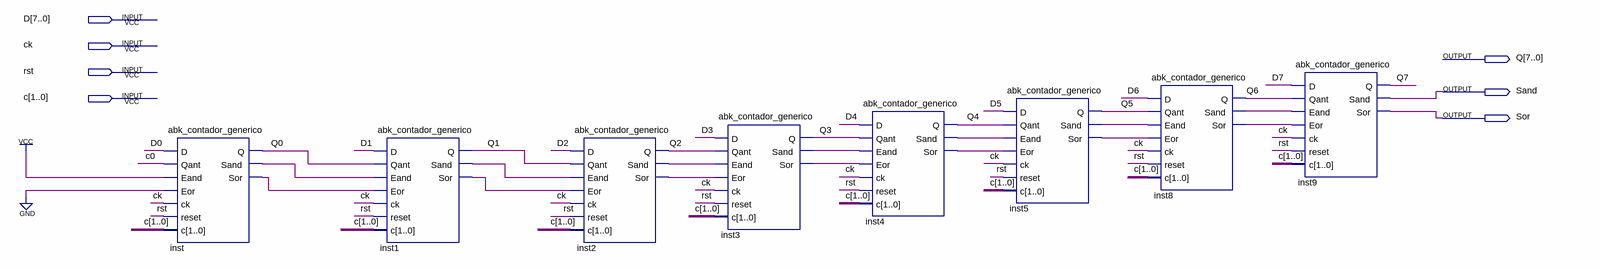
[diagram p0: schematic sheet]
// Quartus schematic abk_contador8bits.bdf as structural Verilog: 8 symbols, 7 pins
module abk_contador8bits (
  input  [7:0] D,
  input  ck,
  input  rst,
  input  [1:0] c,
  output [7:0] Q,
  output Sand,
  output Sor
);

  wire inst1_sand, inst1_sor, inst2_sand, inst2_sor, inst3_sand, inst3_sor, inst4_sand, inst4_sor,
       inst5_sand, inst5_sor, inst8_sand, inst8_sor, inst_sand, inst_sor;

  abk_contador_generico inst (
    .D(D[0]), .Qant(c[0]), .Eand(1'b1), .Eor(1'b0), .ck(ck), .reset(rst), .c(c), .Q(Q[0]), .Sand(inst_sand),
    .Sor(inst_sor));
  abk_contador_generico inst1 (
    .D(D[1]), .Qant(Q[0]), .Eand(inst_sand), .Eor(inst_sor), .ck(ck), .reset(rst), .c(c), .Q(Q[1]),
    .Sand(inst1_sand), .Sor(inst1_sor));
  abk_contador_generico inst2 (
    .D(D[2]), .Qant(Q[1]), .Eand(inst1_sand), .Eor(inst1_sor), .ck(ck), .reset(rst), .c(c), .Q(Q[2]),
    .Sand(inst2_sand), .Sor(inst2_sor));
  abk_contador_generico inst3 (
    .D(D[3]), .Qant(Q[2]), .Eand(inst2_sand), .Eor(inst2_sor), .ck(ck), .reset(rst), .c(c), .Q(Q[3]),
    .Sand(inst3_sand), .Sor(inst3_sor));
  abk_contador_generico inst4 (
    .D(D[4]), .Qant(Q[3]), .Eand(inst3_sand), .Eor(inst3_sor), .ck(ck), .reset(rst), .c(c), .Q(Q[4]),
    .Sand(inst4_sand), .Sor(inst4_sor));
  abk_contador_generico inst5 (
    .D(D[5]), .Qant(Q[4]), .Eand(inst4_sand), .Eor(inst4_sor), .ck(ck), .reset(rst), .c(c), .Q(Q[5]),
    .Sand(inst5_sand), .Sor(inst5_sor));
  abk_contador_generico inst8 (
    .D(D[6]), .Qant(Q[5]), .Eand(inst5_sand), .Eor(inst5_sor), .ck(ck), .reset(rst), .c(c), .Q(Q[6]),
    .Sand(inst8_sand), .Sor(inst8_sor));
  abk_contador_generico inst9 (
    .D(D[7]), .Qant(Q[6]), .Eand(inst8_sand), .Eor(inst8_sor), .ck(ck), .reset(rst), .c(c), .Q(Q[7]),
    .Sand(Sand), .Sor(Sor));
endmodule
